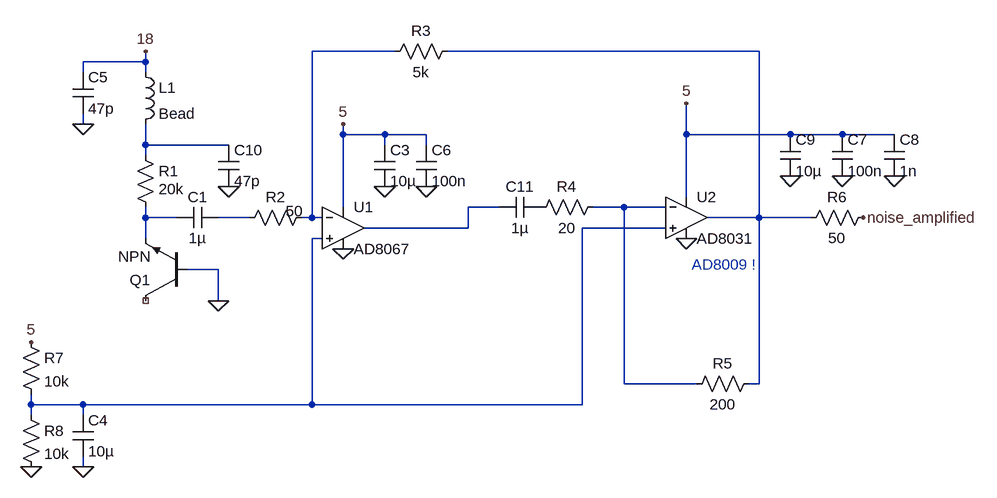
[diagram p0: schematic AD8067Test2.asc]
AD8067Test2.asc, the LTspice schematic file:
Version 4
SHEET 1 1540 680
WIRE 624 -176 496 -176
WIRE 1184 -176 704 -176
WIRE 240 -160 240 -176
WIRE 240 -160 144 -160
WIRE 144 -144 144 -160
WIRE 240 -144 240 -160
WIRE 144 -64 144 -80
WIRE 544 -48 544 -64
WIRE 608 -48 544 -48
WIRE 672 -48 608 -48
WIRE 1072 -48 1072 -96
WIRE 1232 -48 1072 -48
WIRE 1312 -48 1232 -48
WIRE 1392 -48 1312 -48
WIRE 240 -32 240 -64
WIRE 368 -32 240 -32
WIRE 608 -32 608 -48
WIRE 672 -32 672 -48
WIRE 240 -16 240 -32
WIRE 1072 48 1072 -48
WIRE 544 64 544 -48
WIRE 784 64 736 64
WIRE 976 64 928 64
WIRE 1040 64 976 64
WIRE 240 80 240 64
WIRE 288 80 240 80
WIRE 400 80 352 80
WIRE 496 80 496 -176
WIRE 496 80 480 80
WIRE 512 80 496 80
WIRE 1184 80 1184 -176
WIRE 1184 80 1104 80
WIRE 1264 80 1184 80
WIRE 736 96 736 64
WIRE 736 96 576 96
WIRE 1040 96 912 96
WIRE 240 112 240 80
WIRE 512 112 496 112
WIRE 352 160 304 160
WIRE 352 208 352 160
WIRE 976 336 976 64
WIRE 1088 336 976 336
WIRE 1184 336 1184 80
WIRE 1184 336 1168 336
WIRE 64 368 64 352
WIRE 144 368 64 368
WIRE 496 368 496 112
WIRE 496 368 144 368
WIRE 912 368 912 96
WIRE 912 368 496 368
WIRE 64 384 64 368
WIRE 144 384 144 368
WIRE 144 464 144 448
FLAG 352 208 0
FLAG 240 -176 18
FLAG 544 -64 5
FLAG 1072 -96 5
FLAG 608 32 0
FLAG 672 32 0
FLAG 1232 16 0
FLAG 1312 16 0
FLAG 1392 16 0
FLAG 1344 80 noise_amplified
FLAG 64 272 5
FLAG 64 464 0
FLAG 144 464 0
FLAG 368 32 0
FLAG 144 -64 0
FLAG 544 128 0
FLAG 1072 112 0
SYMBOL npn 304 208 R180
SYMATTR InstName Q1
SYMBOL res 224 -32 R0
WINDOW 3 36 68 Left 2
SYMATTR InstName R1
SYMATTR Value 20k
SYMBOL cap 352 64 R90
WINDOW 0 0 32 VBottom 2
WINDOW 3 32 32 VTop 2
SYMATTR InstName C1
SYMATTR Value 1µ
SYMBOL Opamps\\AD8067 544 32 R0
SYMATTR InstName U1
SYMBOL res 496 64 R90
WINDOW 0 0 56 VBottom 2
WINDOW 3 -10 27 VTop 2
SYMATTR InstName R2
SYMATTR Value 50
SYMBOL res 720 -192 R90
WINDOW 0 0 56 VBottom 2
WINDOW 3 32 56 VTop 2
SYMATTR InstName R3
SYMATTR Value 5k
SYMBOL res 1184 320 R90
WINDOW 0 0 56 VBottom 2
WINDOW 3 32 56 VTop 2
SYMATTR InstName R5
SYMATTR Value 200
SYMBOL res 1360 64 R90
WINDOW 0 0 56 VBottom 2
WINDOW 3 32 56 VTop 2
SYMATTR InstName R6
SYMATTR Value 50
SYMBOL cap 592 -32 R0
SYMATTR InstName C3
SYMATTR Value 10µ
SYMBOL cap 656 -32 R0
SYMATTR InstName C6
SYMATTR Value 100n
SYMBOL cap 1296 -48 R0
SYMATTR InstName C7
SYMATTR Value 100n
SYMBOL cap 1376 -48 R0
SYMATTR InstName C8
SYMATTR Value 1n
SYMBOL cap 1216 -48 R0
SYMATTR InstName C9
SYMATTR Value 10µ
SYMBOL res 48 256 R0
SYMATTR InstName R7
SYMATTR Value 10k
SYMBOL res 48 368 R0
SYMATTR InstName R8
SYMATTR Value 10k
SYMBOL cap 128 384 R0
SYMATTR InstName C4
SYMATTR Value 10µ
SYMBOL ind 224 -160 R0
SYMATTR InstName L1
SYMATTR Value Bead
SYMBOL cap 128 -144 R0
SYMATTR InstName C5
SYMATTR Value 47p
SYMBOL cap 352 -32 R0
SYMATTR InstName C10
SYMATTR Value 47p
SYMBOL res 944 48 R90
WINDOW 0 0 56 VBottom 2
WINDOW 3 32 56 VTop 2
SYMATTR InstName R4
SYMATTR Value 20
SYMBOL cap 848 48 R90
WINDOW 0 0 32 VBottom 2
WINDOW 3 32 32 VTop 2
SYMATTR InstName C11
SYMATTR Value 1µ
SYMBOL Opamps\\AD8031 1072 16 R0
SYMATTR InstName U2
TEXT 1080 152 Left 2 ;AD8009 !

The netlist it stands for:
* AD8067Test2.asc
Q1 NC_01 0 N006 0 NPN
R1 N003 N006 20k
C1 N007 N006 1µ
XU1 N008 N001 5 0 N004 AD8067  ; pins In+ In- V+ V- OUT
R2 N001 N007 50
R3 N002 N001 5k
R5 N002 N005 200
R6 noise_amplified N002 50
C3 5 0 10µ
C6 5 0 100n
C7 5 0 100n
C8 5 0 1n
C9 5 0 10µ
R7 5 N008 10k
R8 N008 0 10k
C4 N008 0 10µ
L1 18 N003 Bead
C5 18 0 47p
C10 N003 0 47p
R4 N005 P001 20
C11 P001 N004 1µ
XU2 N008 N005 5 0 N002 AD8031  ; pins In+ In- V+ V- OUT
.model NPN NPN
.model PNP PNP
.lib standard.bjt
* AD8009 !
.backanno
.end